# Altium project LimePSB-RPCM_1v2.PrjPcb (part 3 of 13)

## Sheet 07_Misc_2.SchDoc: Misc 2
size A3; Organization: Lime Microsystems; Address1: Surrey Tech Centre; Address2: Guildford GU2 7YG; Address3: Surrey; Address4: United Kingdom; Revision: v1.2; SheetNumber: 7; SheetTotal: 13
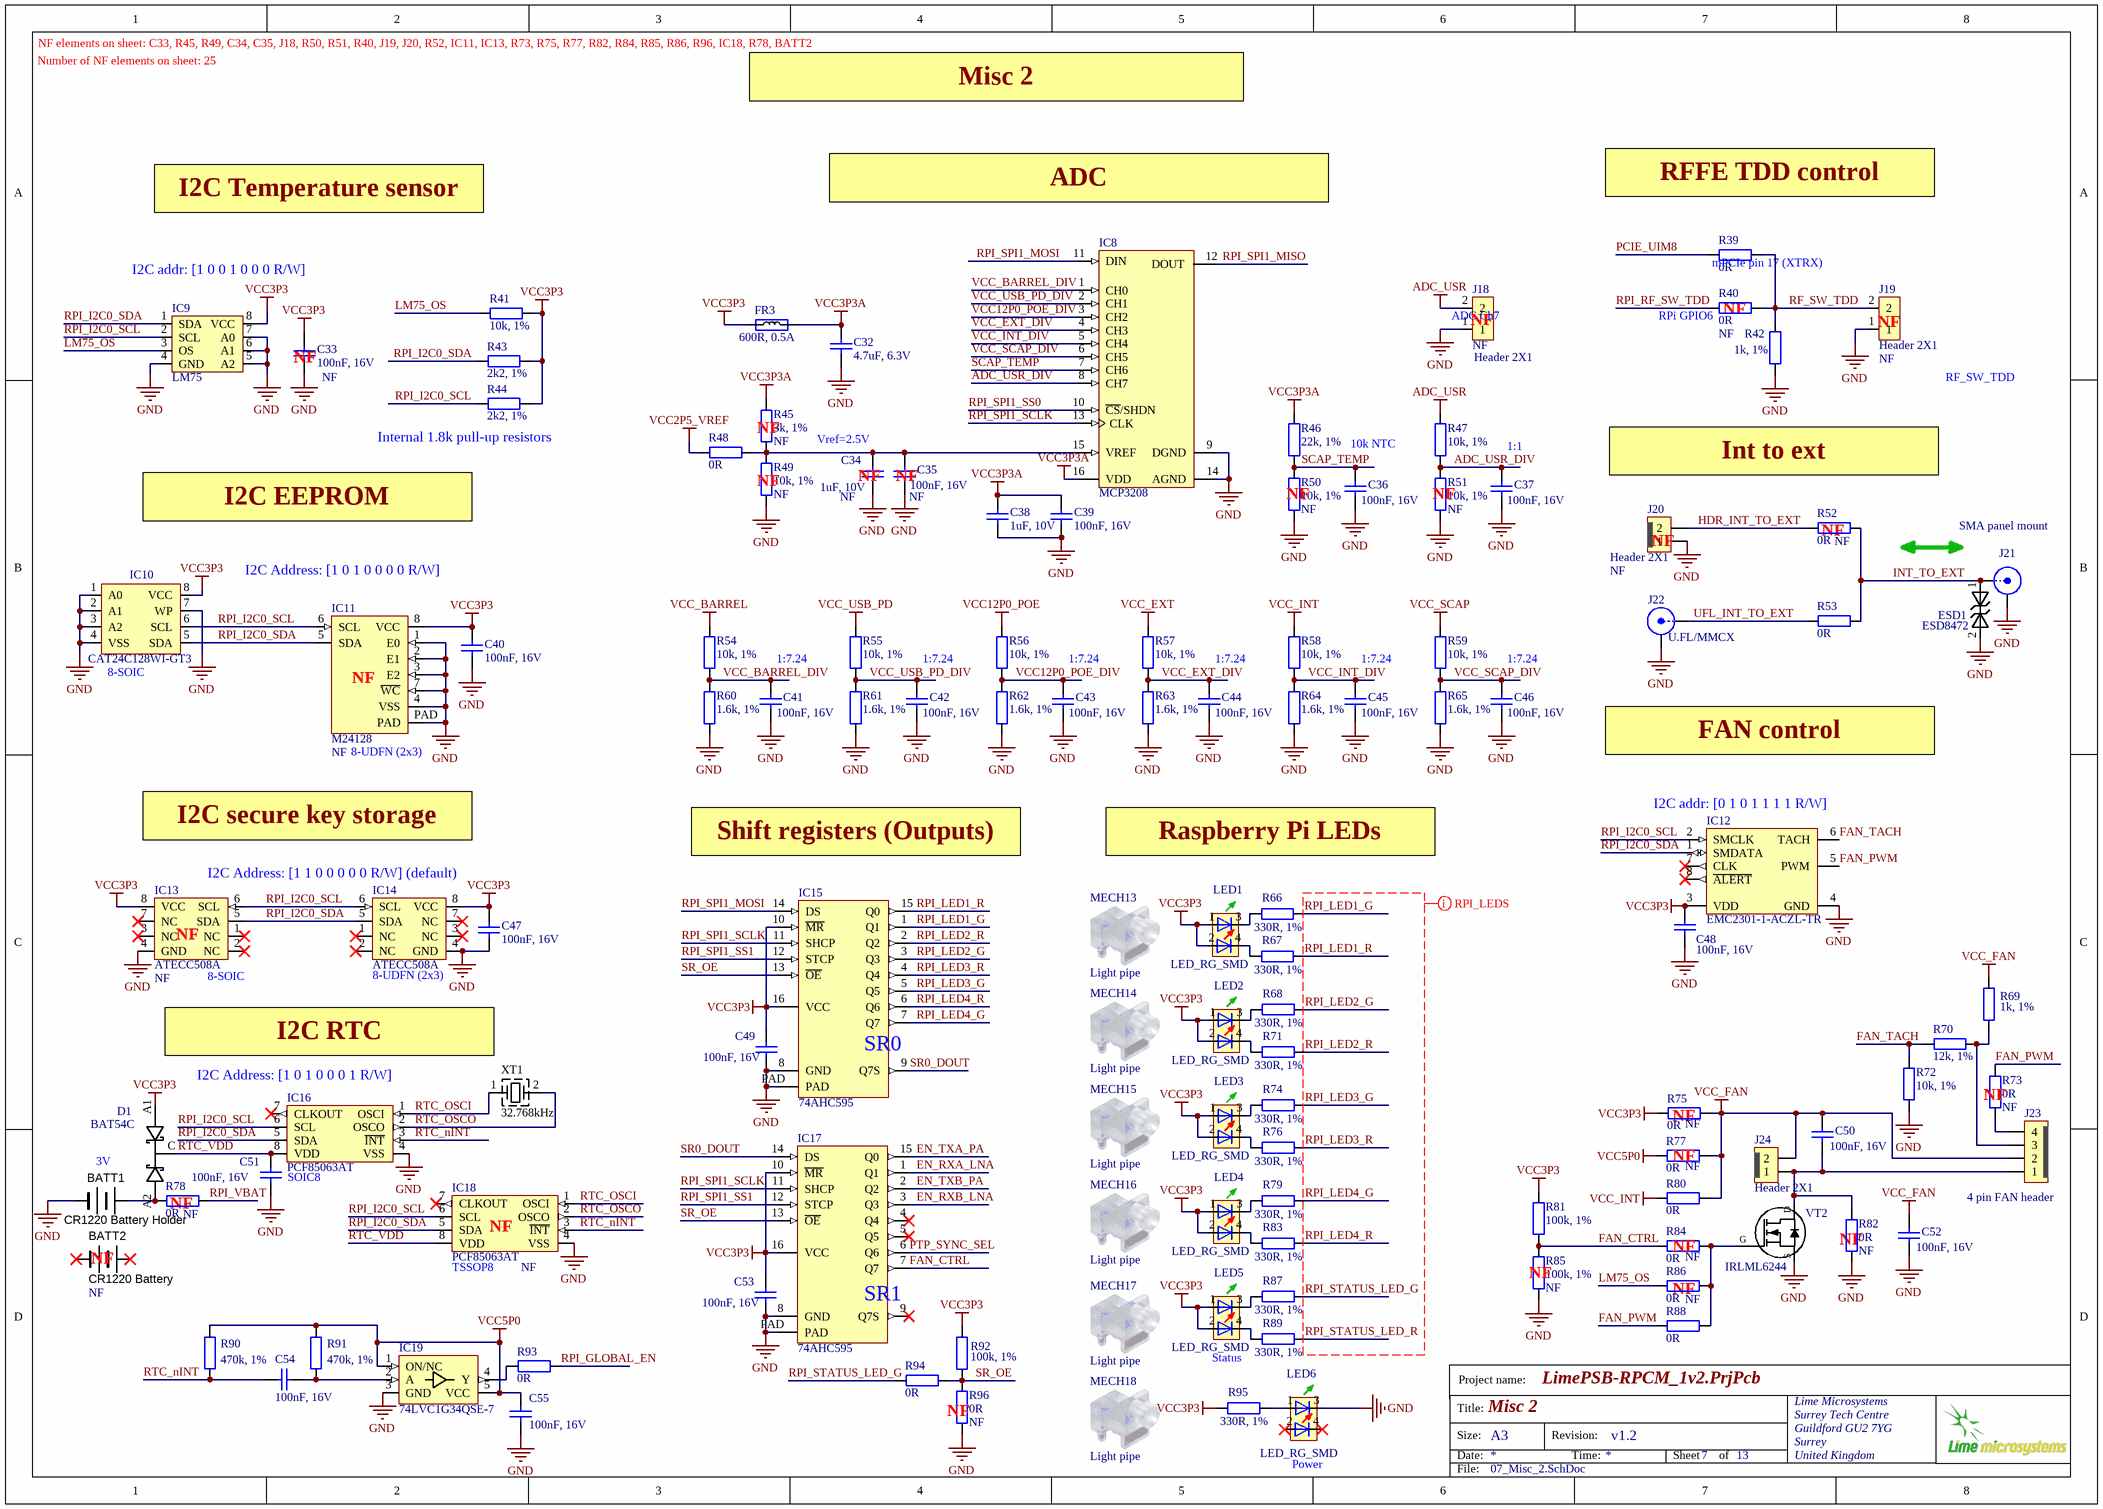
[diagram p6: 07_Misc_2.SchDoc]

### Parts
BATT1  CR1220 Battery Holder  [CR1220_SMD_holder]
BATT2  CR1220 Battery  Assembly Info: NF  (mechanical)
C32  4.7uF, 6.3V  [CAP0402]
C33  100nF, 16V  Assembly Info: NF  [CAP0402]
C34  1uF, 10V  Assembly Info: NF  [CAP0402]
C35  100nF, 16V  Assembly Info: NF  [CAP0402]
C36  100nF, 16V  [CAP0402]
C37  100nF, 16V  [CAP0402]
C38  1uF, 10V  [CAP0402]
C39  100nF, 16V  [CAP0402]
C40  100nF, 16V  [CAP0402]
C41  100nF, 16V  [CAP0402]
C42  100nF, 16V  [CAP0402]
C43  100nF, 16V  [CAP0402]
C44  100nF, 16V  [CAP0402]
C45  100nF, 16V  [CAP0402]
C46  100nF, 16V  [CAP0402]
C47  100nF, 16V  [CAP0402]
C48  100nF, 16V  [CAP0402]
C49  100nF, 16V  [CAP0402]
C50  100nF, 16V  [CAP0402]
C51  100nF, 16V  [CAP0402]
C52  100nF, 16V  [CAP0402]
C53  100nF, 16V  [CAP0402]
C54  100nF, 16V  [CAP0402]
C55  100nF, 16V  [CAP0402]
D1  BAT54C  [BAT54C_SOT23-3]
ESD1  ESD8472  [ESD8472_X3DFN2]
FR3  600R, 0.5A  [RES0402]
IC8  MCP3208  [MCP3208-CI/SL_SOIC16]
IC9  LM75  [HWSON8_LM75]
IC10  CAT24C128WI-GT3  [SOIC127P600-8DL_v2]
IC11  M24128  Assembly Info: NF  [M24128-DFMC6TG]
IC12  EMC2301-1-ACZL-TR  [EMC2301-1-ACZL-TR_MOTOR_DRIVER_TSSOP8]
IC13  ATECC508A  Assembly Info: NF  [SOIC127P600-8DL_v2]
IC14  ATECC508A  [ATECC508A_UDFN8]
IC15  74AHC595  [74HC595BQ,115]
IC16  PCF85063AT  [PCF85063AT_RTC_SOIC-8]
IC17  74AHC595  [74HC595BQ,115]
IC18  PCF85063AT  Assembly Info: NF  [PCF85063AT_RTC_TSSOP8]
IC19  74LVC1G34QSE-7  [74AHCT1G126SE-7_BUFFER_SOT353]
J18  Header 2X1  Assembly Info: NF  [HDR_1x2]
J19  Header 2X1  Assembly Info: NF  [HDR_1x2]
J20  Header 2X1  Assembly Info: NF  [Header1x2_TH_LOCKING]
J21  SMA panel mount  [SMA_connector_side]
J22  U.FL/MMCX  [MMCX_UFL_conn_u]
J23  4 pin FAN header  [Header1x4_TH_LOCKING_v2]
J24  Header 2X1  [Header1x2_TH_LOCKING]
LED1  LED_RG_SMD  [LED-2x0603]
LED2  LED_RG_SMD  [LED-2x0603]
LED3  LED_RG_SMD  [LED-2x0603]
LED4  LED_RG_SMD  [LED-2x0603]
LED5  LED_RG_SMD  [LED-2x0603]
LED6  LED_RG_SMD  [LED-2x0603]
MECH13  Light pipe  [LIGHT_PIPE_RIGHT_ANGLE_SLP3-200-100-F]
MECH14  Light pipe  [LIGHT_PIPE_RIGHT_ANGLE_SLP3-200-100-F]
MECH15  Light pipe  [LIGHT_PIPE_RIGHT_ANGLE_SLP3-200-100-F]
MECH16  Light pipe  [LIGHT_PIPE_RIGHT_ANGLE_SLP3-200-100-F]
MECH17  Light pipe  [LIGHT_PIPE_RIGHT_ANGLE_SLP3-200-100-F]
MECH18  Light pipe  [LIGHT_PIPE_RIGHT_ANGLE_SLP3-200-100-F]
R39  0R  [RES0402]
R40  0R  Assembly Info: NF  [RES0402]
R41  10k, 1%  [RES0402]
R42  1k, 1%  [RES0402]
R43  2k2, 1%  [RES0402]
R44  2k2, 1%  [RES0402]
R45  3k, 1%  Assembly Info: NF  [RES0402]
R46  22k, 1%  [RES0402]
R47  10k, 1%  [RES0402]
R48  0R  [RES0402_v2]
R49  10k, 1%  Assembly Info: NF  [RES0402]
R50  10k, 1%  Assembly Info: NF  [RES0402]
R51  10k, 1%  Assembly Info: NF  [RES0402]
R52  0R  Assembly Info: NF  [RES0402_v2]
R53  0R  [RES0402_v2]
R54  10k, 1%  [RES0402]
R55  10k, 1%  [RES0402]
R56  10k, 1%  [RES0402]
R57  10k, 1%  [RES0402]
R58  10k, 1%  [RES0402]
R59  10k, 1%  [RES0402]
R60  1.6k, 1%  [RES0402]
R61  1.6k, 1%  [RES0402]
R62  1.6k, 1%  [RES0402]
R63  1.6k, 1%  [RES0402]
R64  1.6k, 1%  [RES0402]
R65  1.6k, 1%  [RES0402]
R66  330R, 1%  [RES0402]
R67  330R, 1%  [RES0402]
R68  330R, 1%  [RES0402]
R69  1k, 1%  [RES0402]
R70  12k, 1%  [RES0402]
R71  330R, 1%  [RES0402]
R72  10k, 1%  [RES0402]
R73  0R  Assembly Info: NF  [RES0402]
R74  330R, 1%  [RES0402]
R75  0R  Assembly Info: NF  [RES0402]
R76  330R, 1%  [RES0402]
R77  0R  Assembly Info: NF  [RES0402]
R78  0R  Assembly Info: NF  [RES0402]
R79  330R, 1%  [RES0402]
R80  0R  [RES0402]
R81  100k, 1%  [RES0402]
R82  0R  Assembly Info: NF  [RES0402]
R83  330R, 1%  [RES0402]
R84  0R  Assembly Info: NF  [RES0402]
R85  100k, 1%  Assembly Info: NF  [RES0402]
R86  0R  Assembly Info: NF  [RES0402]
R87  330R, 1%  [RES0402]
R88  0R  [RES0402]
R89  330R, 1%  [RES0402]
R90  470k, 1%  [RES0402]
R91  470k, 1%  [RES0402]
R92  100k, 1%  [RES0402]
R93  0R  [RES0402]
R94  0R  [RES0402]
R95  330R, 1%  [RES0402]
R96  0R  Assembly Info: NF  [RES0402]
VT2  IRLML6244  [SOT23-3]
XT1  32.768kHz  [CRYSTAL_2PIN_RTC_RT3215]

### Nets
ADC_USR: J18.2 R47.1
GND: BATT1.NEGATIVE C32.1 C33.2 C34.1 C35.2 C36.2 C37.2 C38.1 C39.1 C40.2 C41.2 C42.2 C43.2 C44.2 C45.2 C46.2 C47.2 C48.2 C49.1 C51.2 C52.2 C53.1 C55.2 ESD1.2 IC8.9(DGND) IC8.14(AGND) IC9.4(GND) IC9.5(A2) IC9.6(A1) IC9.7(A0) IC10.1(A0) IC10.2(A1) IC10.3(A2) IC10.4(VSS) IC10.7(WP) IC11.1(E0) IC11.2(E1) IC11.3(E2) IC11.4(VSS) IC11.7(~{WC}) IC11.PAD IC12.4(GND) IC13.4(GND) IC14.4(GND) IC15.8(GND) IC15.PAD IC16.4(VSS) IC17.8(GND) IC17.PAD IC18.4(VSS) IC19.3(GND) J18.1 J19.1 J20.1 J21.2(Y) J22.2(Y) LED6.3 R42.2 R49.2 R50.2 R51.2 R60.1 R61.1 R62.1 R63.1 R64.1 R65.1 R72.2 R82.1 R85.2 R96.2 VT2.S
VCC2P5_VREF: R48.1
VCC3P3: C33.1 C40.1 C47.1 C48.1 C49.2 C53.2 D1.A1 FR3.1 IC9.8(VCC) IC10.8(VCC) IC11.8(VCC) IC12.3(VDD) IC13.8(VCC) IC14.8(VCC) IC15.10(~{MR}) IC15.16(VCC) IC17.10(~{MR}) IC17.16(VCC) LED1.1 LED1.2 LED2.1 LED2.2 LED3.1 LED3.2 LED4.1 LED4.2 LED5.1 LED5.2 R41.2 R43.2 R44.2 R75.1 R81.1 R92.1 R95.2
VCC3P3A: C32.2 C38.2 C39.2 FR3.2 IC8.16(VDD) R45.2 R46.1
VCC5P0: C55.1 IC19.1(ON/NC) IC19.5(VCC) R77.1 R90.2 R91.2
VCC12P0_POE: R56.1
VCC_BARREL: R54.1
VCC_EXT: R57.1
VCC_FAN: C50.1 C52.1 J23.2 J24.2 R69.1 R75.2 R77.2 R80.2
VCC_INT: R58.1 R80.1
VCC_SCAP: R59.1
VCC_USB_PD: R55.1
ADC_USR_DIV: C37.1 IC8.8(CH7) R47.2 R51.1
EN_RXA_LNA: IC17.1(Q1)
EN_RXB_LNA: IC17.3(Q3)
EN_TXA_PA: IC17.15(Q0)
EN_TXB_PA: IC17.2(Q2)
FAN_CTRL: IC17.7(Q7) R81.2 R84.1 R85.1
FAN_PWM: IC12.5(PWM) R73.2 R88.1
FAN_TACH: IC12.6(TACH) R70.2 R72.1
HDR_INT_TO_EXT: J20.2 R52.2
INT_TO_EXT: ESD1.1 J21.1(X) R52.1 R53.1
LM75_OS: IC9.3(OS) R41.1 R86.1
PCIE_UIM8: R39.2
PTP_SYNC_SEL: IC17.6(Q6)
RF_SW_TDD: J19.2 R39.1 R40.1 R42.1
RPI_GLOBAL_EN: R93.1
RPI_I2C0_SCL: IC9.2(SCL) IC10.6(SCL) IC11.6(SCL) IC12.2(SMCLK) IC13.6(SCL) IC14.6(SCL) IC16.6(SCL) IC18.6(SCL) R44.1
RPI_I2C0_SDA: IC9.1(SDA) IC10.5(SDA) IC11.5(SDA) IC12.1(SMDATA) IC13.5(SDA) IC14.5(SDA) IC16.5(SDA) IC18.5(SDA) R43.1
RPI_LED1_G: IC15.1(Q1) R66.1
RPI_LED1_R: IC15.15(Q0) R67.1
RPI_LED2_G: IC15.3(Q3) R68.1
RPI_LED2_R: IC15.2(Q2) R71.1
RPI_LED3_G: IC15.5(Q5) R74.1
RPI_LED3_R: IC15.4(Q4) R76.1
RPI_LED4_G: IC15.7(Q7) R79.1
RPI_LED4_R: IC15.6(Q6) R83.1
RPI_RF_SW_TDD: R40.2
RPI_SPI1_MISO: IC8.12(DOUT)
RPI_SPI1_MOSI: IC8.11(DIN) IC15.14(DS)
RPI_SPI1_SCLK: IC8.13(CLK) IC15.11(SHCP) IC17.11(SHCP)
RPI_SPI1_SS0: IC8.10(~{CS}/SHDN)
RPI_SPI1_SS1: IC15.12(STCP) IC17.12(STCP)
RPI_STATUS_LED_G: R87.1 R94.2
RPI_STATUS_LED_R: R89.1
RPI_VBAT: R78.1
RTC_nINT: C54.1 IC16.3(~{INT}) IC18.3(~{INT}) R90.1
RTC_OSCI: IC16.1(OSCI) IC18.1(OSCI) XT1.1(X)
RTC_OSCO: IC16.2(OSCO) IC18.2(OSCO) XT1.2(X)
RTC_VDD: C51.1 D1.C IC16.8(VDD) IC18.8(VDD)
SCAP_TEMP: C36.1 IC8.7(CH6) R46.2 R50.1
SR0_DOUT: IC15.9(Q7S) IC17.14(DS)
SR_OE: IC15.13(~{OE}) IC17.13(~{OE}) R92.2 R94.1 R96.1
UFL_INT_TO_EXT: J22.1(X) R53.2
VCC12P0_POE_DIV: C43.1 IC8.3(CH2) R56.2 R62.2
VCC_BARREL_DIV: C41.1 IC8.1(CH0) R54.2 R60.2
VCC_EXT_DIV: C44.1 IC8.4(CH3) R57.2 R63.2
VCC_INT_DIV: C45.1 IC8.5(CH4) R58.2 R64.2
VCC_SCAP_DIV: C46.1 IC8.6(CH5) R59.2 R65.2
VCC_USB_PD_DIV: C42.1 IC8.2(CH1) R55.2 R61.2
NetBATT1_POSITIVE: BATT1.POSITIVE D1.A2 R78.2
NetC34_2: C34.2 C35.1 IC8.15(VREF) R45.1 R48.2 R49.1
NetC50_2: C50.2 J23.1 J24.1 R82.2 VT2.D
NetC54_2: C54.2 IC19.2(A) R91.1
NetIC19_4: IC19.4(Y) R93.2
NetJ23_3: J23.3 R69.2 R70.1
NetJ23_4: J23.4 R73.1
NetLED1_3: LED1.3 R66.2
NetLED1_4: LED1.4 R67.2
NetLED2_3: LED2.3 R68.2
NetLED2_4: LED2.4 R71.2
NetLED3_3: LED3.3 R74.2
NetLED3_4: LED3.4 R76.2
NetLED4_3: LED4.3 R79.2
NetLED4_4: LED4.4 R83.2
NetLED5_3: LED5.3 R87.2
NetLED5_4: LED5.4 R89.2
NetLED6_1: LED6.1 R95.1
NetR84_2: R84.2 R86.2 R88.2 VT2.G

Not connected (* = marked no-connect by the designer): BATT2 NEGATIVE* POSITIVE*; IC12 7(CLK)* 8(~{ALERT})*; IC13 1(NC)* 2(NC)* 3(NC)* 7(NC)*; IC14 1(NC)* 2(NC)* 3(NC)* 7(NC)*; IC16 7(CLKOUT)*; IC17 4(Q4)* 5(Q5)* 9(Q7S)*; IC18 7(CLKOUT)*; LED6 2* 4*

### Layout directives
net class RPI_LEDS: RPI_LED1_G, RPI_LED1_R, RPI_LED2_G, RPI_LED2_R, RPI_LED3_G, RPI_LED3_R, RPI_LED4_G, RPI_LED4_R, RPI_STATUS_LED_G, RPI_STATUS_LED_R

### Notes on the sheet
- NF elements on sheet: C33, R45, R49, C34, C35, J18, R50, R51, R40, J19, J20, R52, IC11, IC13, R73, R75, R77, R82, R84, R85, R86, R96, IC18, R78, BATT2
- Number of NF elements on sheet: 25
- Misc 2
- I2C Temperature sensor
- ADC
- RFFE TDD control
- I2C addr: [1 0 0 1 0 0 0 R/W]
- (near R39) mPCIe pin 17 (XTRX)
- (near R40) NF
- (near C33) NF
- (near J18) ADC Ch7
- (near J18) NF
- RPi GPIO6
- (near J19) NF
- (near J19) RF_SW_TDD
- (near R44) Internal 1.8k pull-up resistors
- (near R45) NF
- (near C34) Vref=2.5V
- 10k NTC
- (near C37) 1:1
- I2C EEPROM
- (near R49) NF
- (near C34) NF
- (near C35) NF
- (near R50) NF
- (near R51) NF
- Int to ext
- I2C Address: [1 0 1 0 0 0 0 R/W]
- (near J20) NF
- (near R52) NF
- (near IC10) 8-SOIC
- (near IC11) NF
- 1:7.24
- (near C46) 1:7.24
- (near IC11) 8-UDFN (2x3)
- FAN control
- I2C secure key storage
- Shift registers (Outputs)
- Raspberry Pi LEDs
- (near IC12) I2C addr: [0 1 0 1 1 1 1 R/W]
- I2C Address: [1 1 0 0 0 0 0 R/W] (default)
- (near IC13) NF
- (near IC13) 8-SOIC
- (near IC14) 8-UDFN (2x3)
- I2C RTC
- (near IC15) SR0
- (near IC16) I2C Address: [1 0 1 0 0 0 1 R/W]
- (near R75) NF
- (near R73) NF
- 3V
- SOIC8
- (near R77) NF
- (near R78) NF
- (near IC18) NF
- (near R84) NF
- (near R82) NF
- (near BATT2) NF
- (near IC18) TSSOP8
- (near IC17) SR1
- (near R85) NF
- (near R86) NF
- Status
- (near R96) NF
- (near LED6) Power
- Project name:
- Title:
- Size:
- Date:
- A3
- Revision:
- Time:
- Sheet
- of
- File: